# Altium schematic sheet 0036_PCH_DMI.SchDoc
size 848 x 558 mm
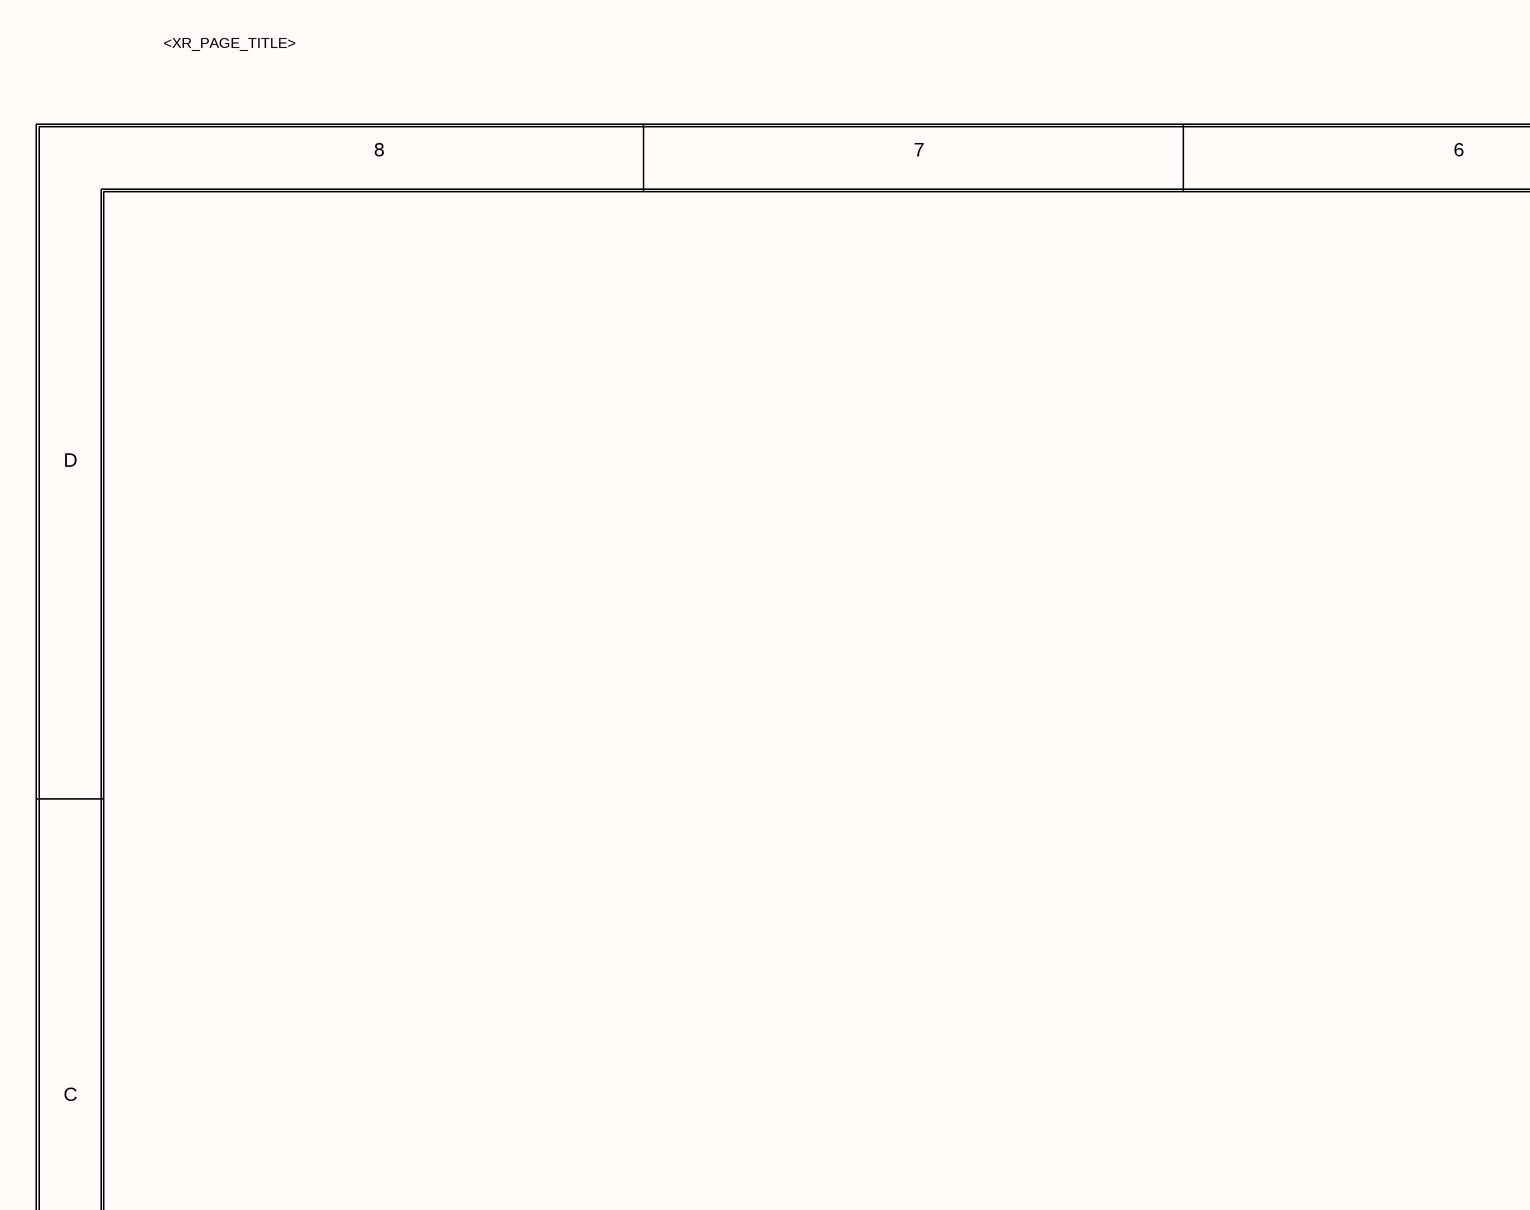
[diagram p0: 0036_PCH_DMI.SchDoc, top left]
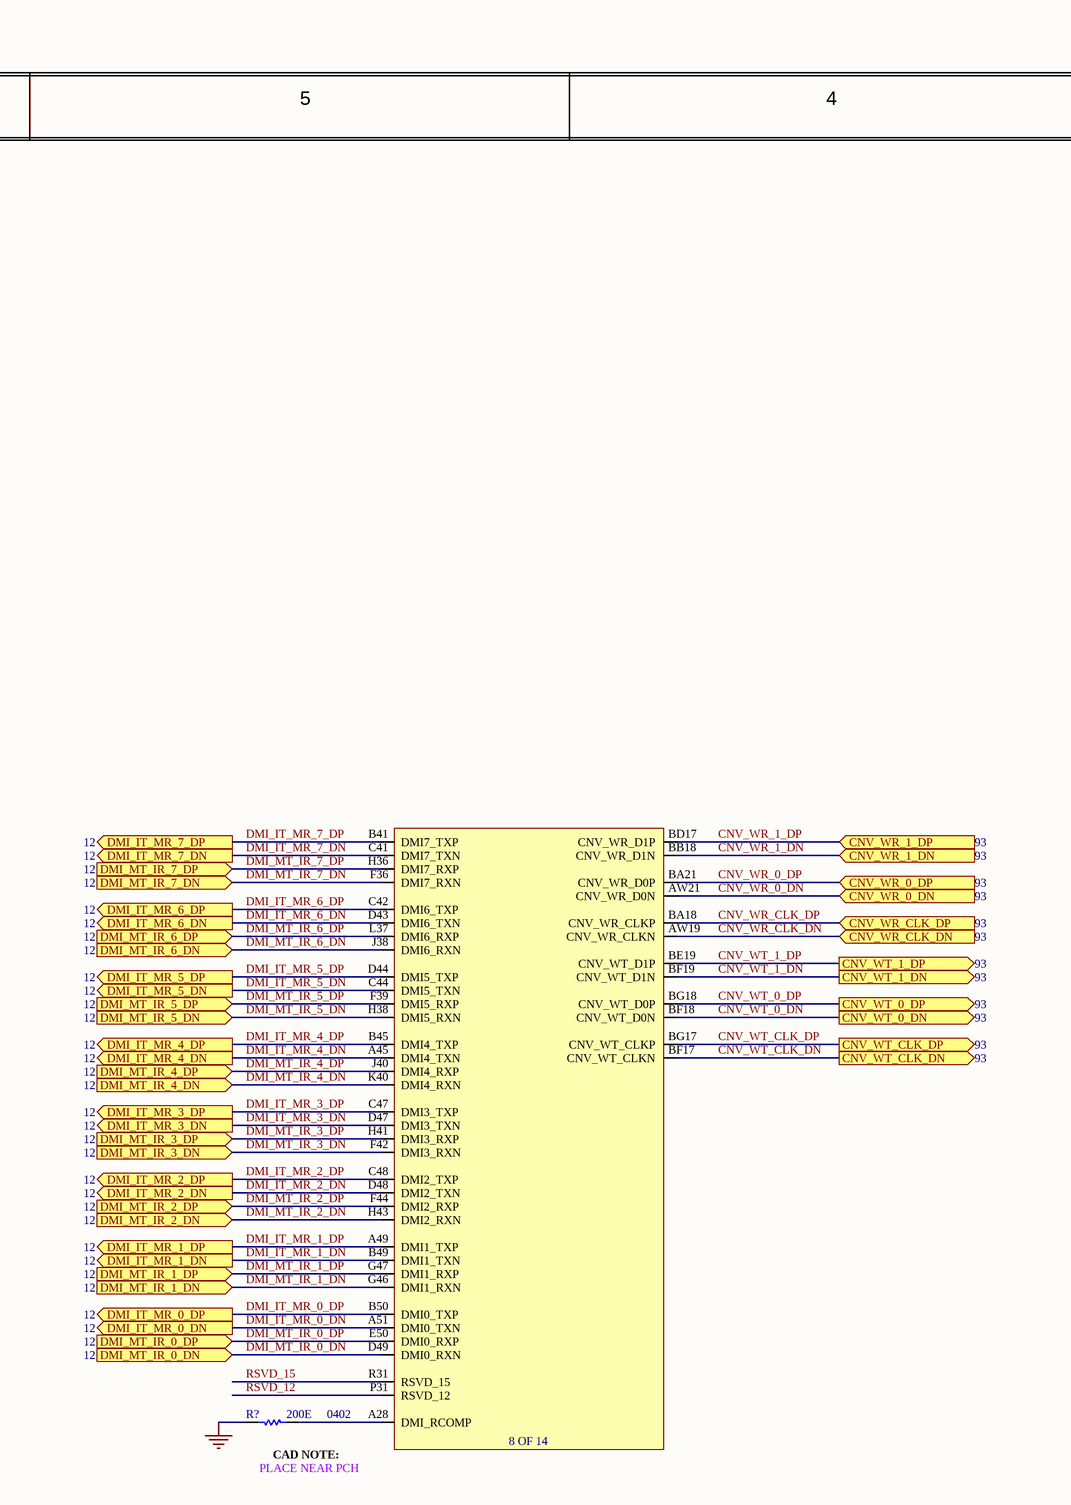
[diagram p1: 0036_PCH_DMI.SchDoc, top middle]
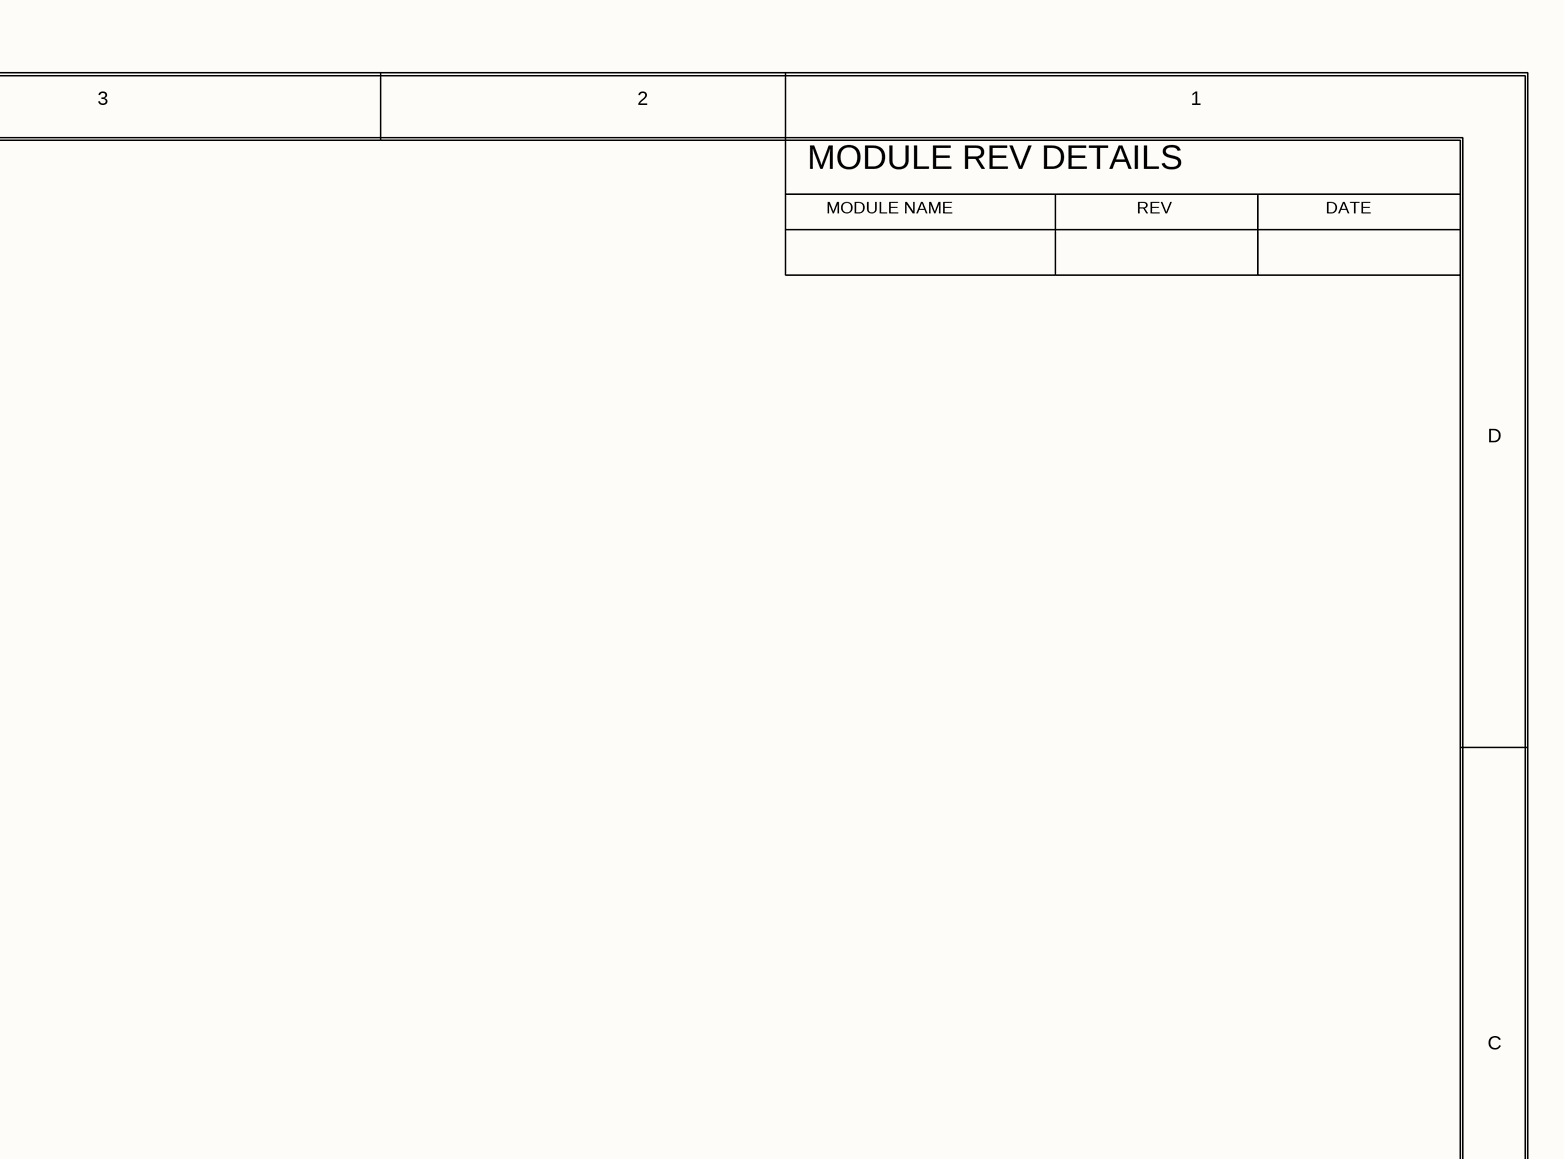
[diagram p2: 0036_PCH_DMI.SchDoc, top right]
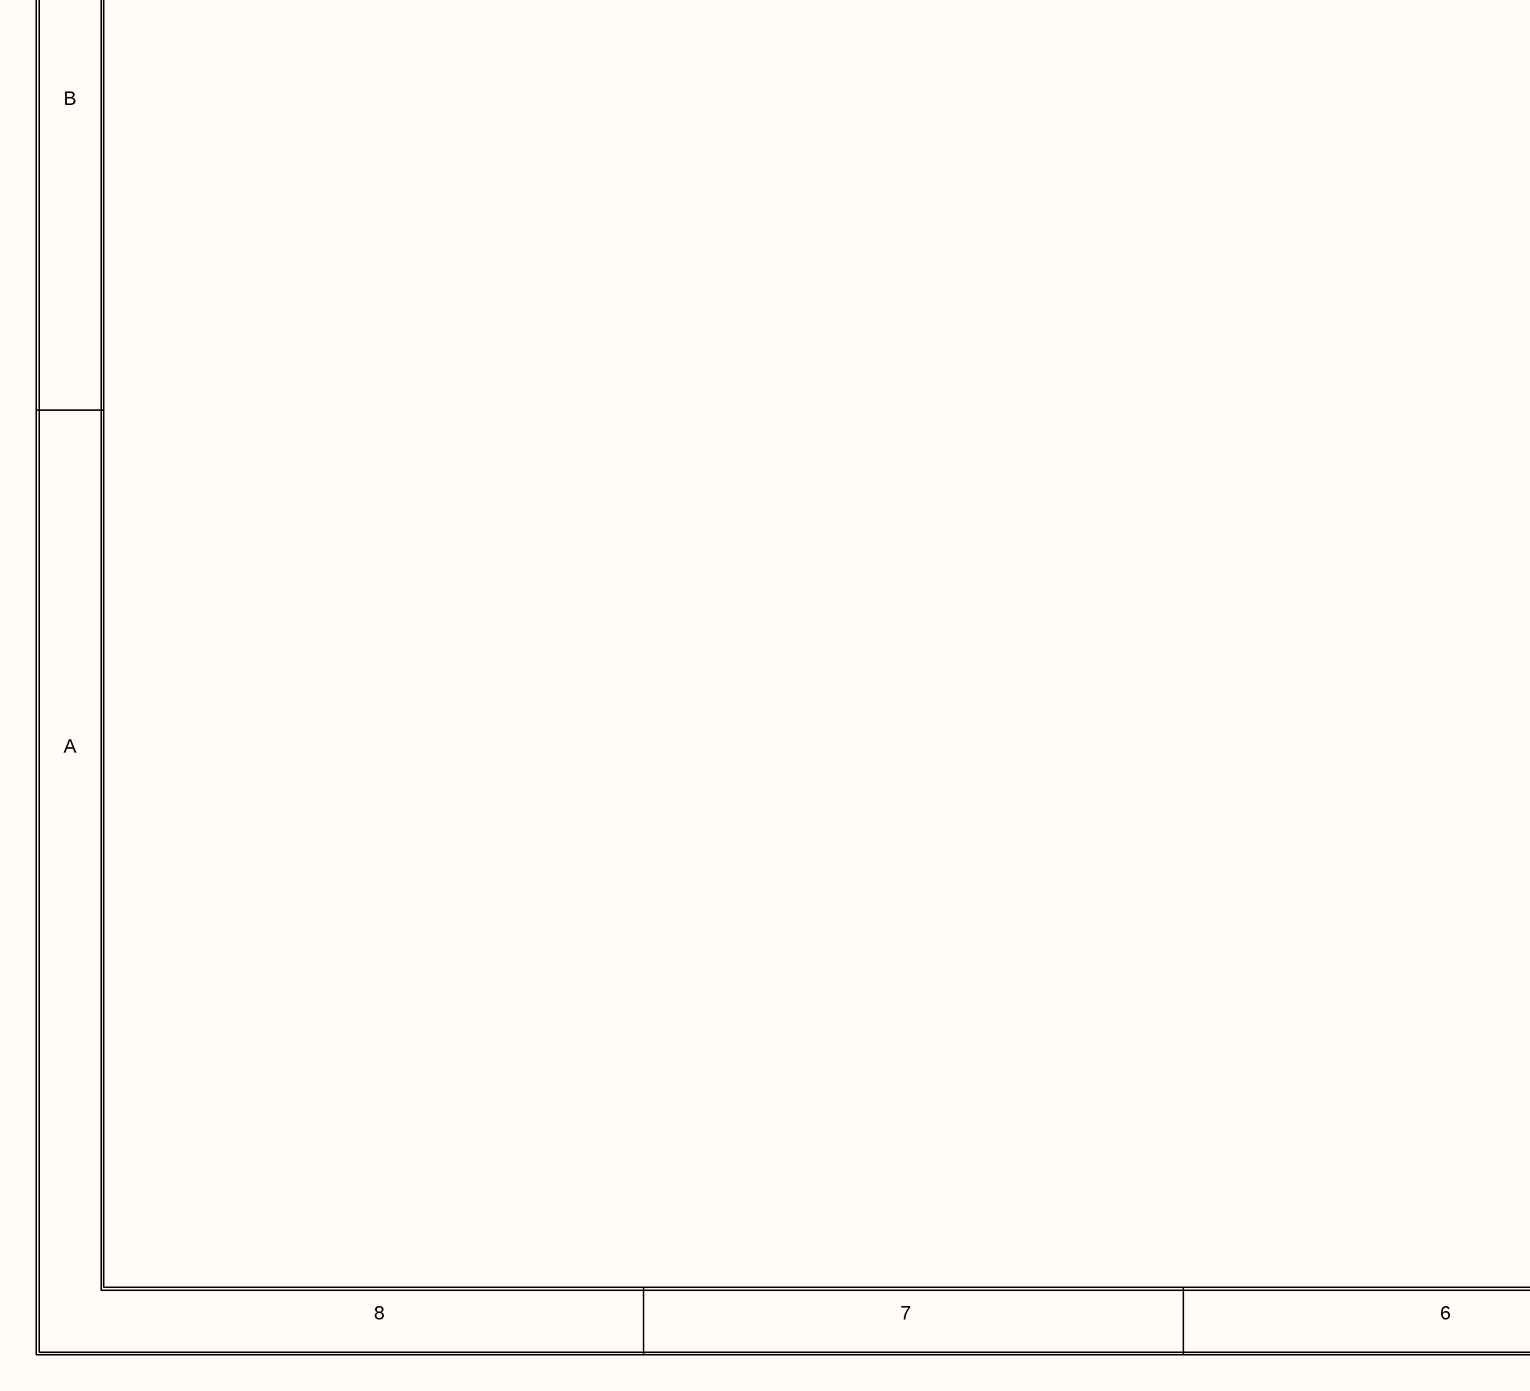
[diagram p3: 0036_PCH_DMI.SchDoc, bottom left]
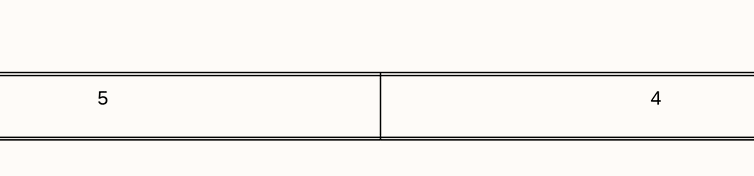
[diagram p4: 0036_PCH_DMI.SchDoc, bottom middle]
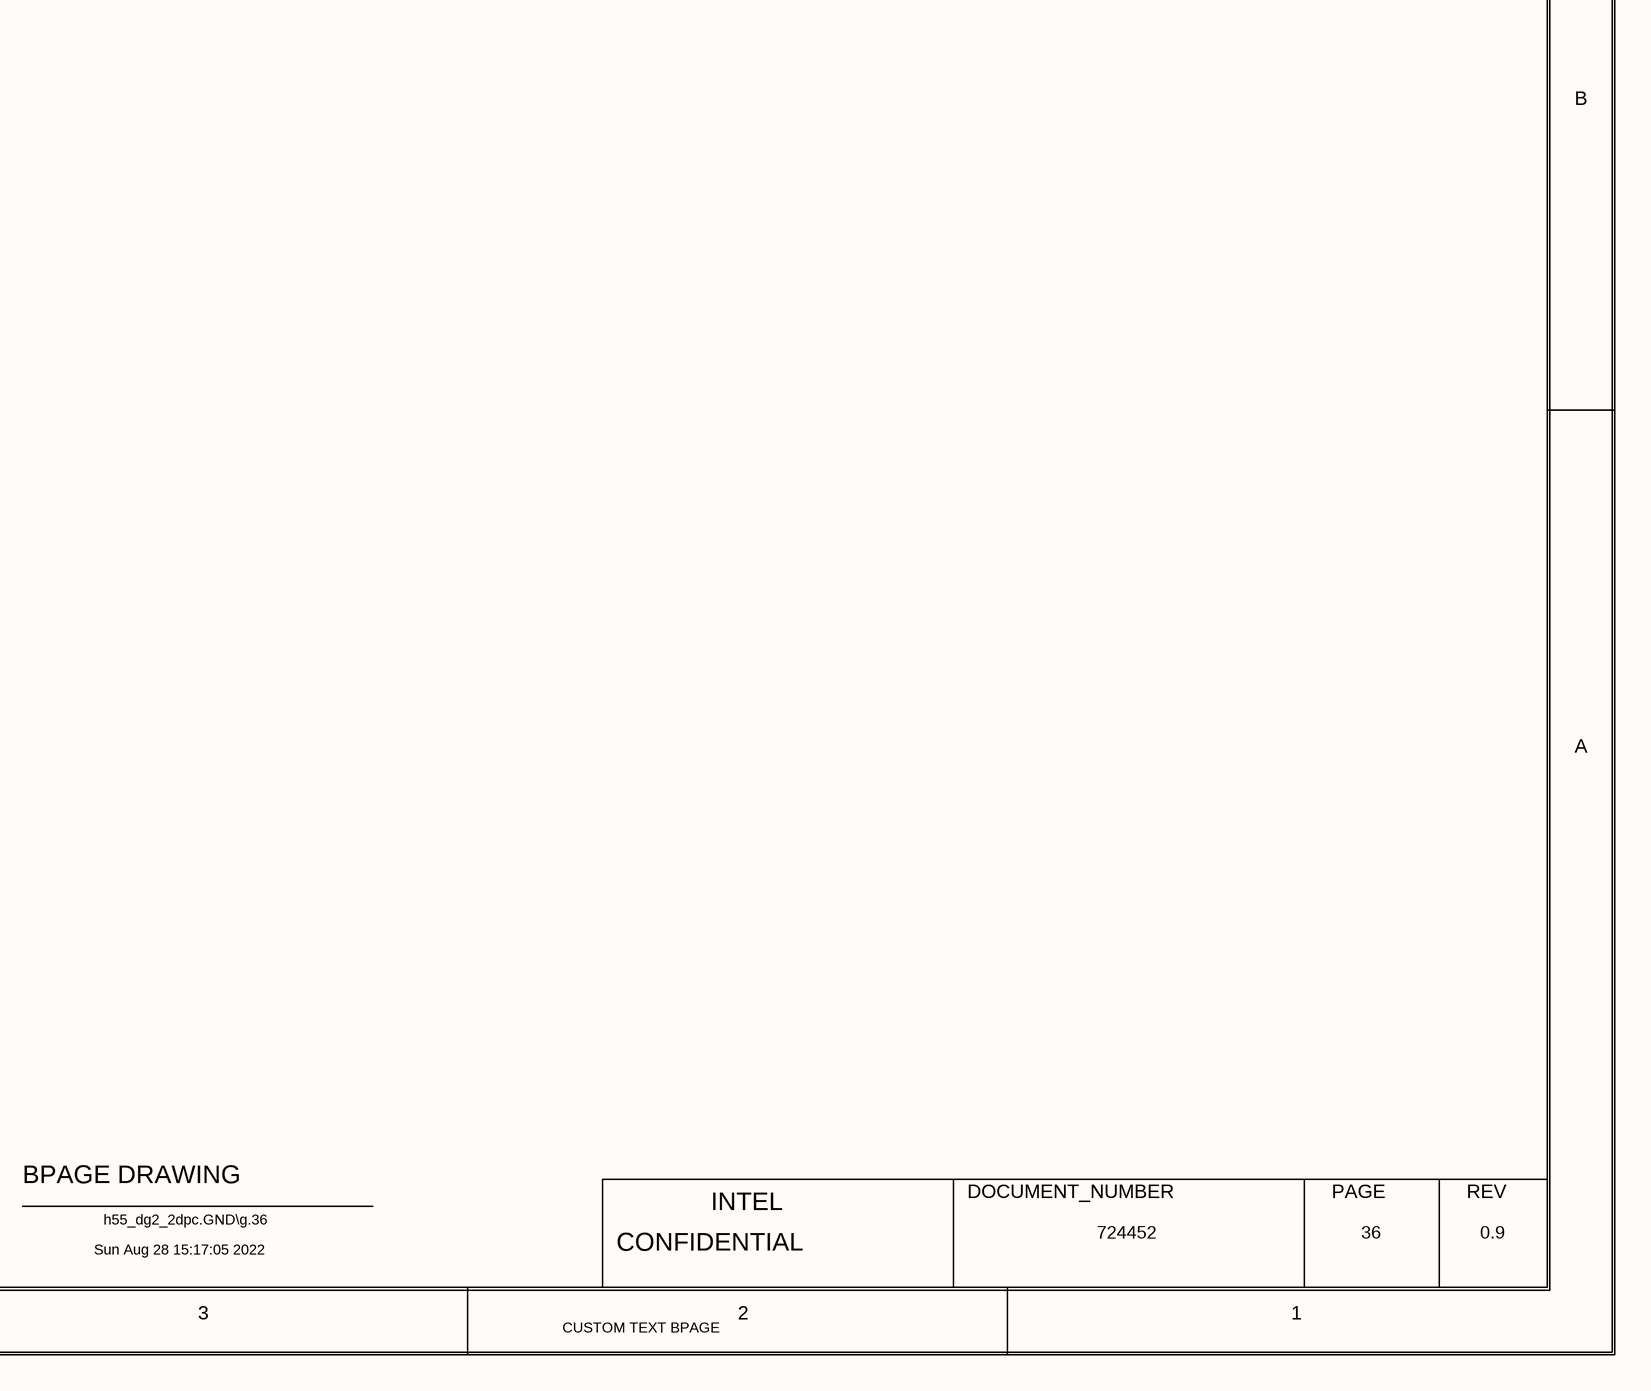
[diagram p5: 0036_PCH_DMI.SchDoc, bottom right]

## Parts
R?  value 200E  Case/Package: 0402  [RESC0402]  (hidden comment: Res)
U23601  C_RPL_S_PCH_EXT  (value not drawn)  (part H of 14)

## Ports
CNV_WR_0_DN (in), CNV_WR_0_DP (in), CNV_WR_1_DN (in), CNV_WR_1_DP (in), CNV_WR_CLK_DN (in), CNV_WR_CLK_DP (in), CNV_WT_0_DN (out), CNV_WT_0_DP (out), CNV_WT_1_DN (out), CNV_WT_1_DP (out), CNV_WT_CLK_DN (out), CNV_WT_CLK_DP (out), DMI_IT_MR_0_DN (out), DMI_IT_MR_0_DP (out), DMI_IT_MR_1_DN (out), DMI_IT_MR_1_DP (out), DMI_IT_MR_2_DN (out), DMI_IT_MR_2_DP (out), DMI_IT_MR_3_DN (out), DMI_IT_MR_3_DP (out), DMI_IT_MR_4_DN (out), DMI_IT_MR_4_DP (out), DMI_IT_MR_5_DN (out), DMI_IT_MR_5_DP (out), DMI_IT_MR_6_DN (out), DMI_IT_MR_6_DP (out), DMI_IT_MR_7_DN (out), DMI_IT_MR_7_DP (out), DMI_MT_IR_0_DN (in), DMI_MT_IR_0_DP (in), DMI_MT_IR_1_DN (in), DMI_MT_IR_1_DP (in), DMI_MT_IR_2_DN (in), DMI_MT_IR_2_DP (in), DMI_MT_IR_3_DN (in), DMI_MT_IR_3_DP (in), DMI_MT_IR_4_DN (in), DMI_MT_IR_4_DP (in), DMI_MT_IR_5_DN (in), DMI_MT_IR_5_DP (in), DMI_MT_IR_6_DN (in), DMI_MT_IR_6_DP (in), DMI_MT_IR_7_DN (in), DMI_MT_IR_7_DP (in)

## Nets
GND: R?.1
CNV_WR_0_DN: U23601.AW21(CNV_WR_D0N) ; port CNV_WR_0_DN
CNV_WR_0_DP: U23601.BA21(CNV_WR_D0P) ; port CNV_WR_0_DP
CNV_WR_1_DN: U23601.BB18(CNV_WR_D1N) ; port CNV_WR_1_DN
CNV_WR_1_DP: U23601.BD17(CNV_WR_D1P) ; port CNV_WR_1_DP
CNV_WR_CLK_DN: U23601.AW19(CNV_WR_CLKN) ; port CNV_WR_CLK_DN
CNV_WR_CLK_DP: U23601.BA18(CNV_WR_CLKP) ; port CNV_WR_CLK_DP
CNV_WT_0_DN: U23601.BF18(CNV_WT_D0N) ; port CNV_WT_0_DN
CNV_WT_0_DP: U23601.BG18(CNV_WT_D0P) ; port CNV_WT_0_DP
CNV_WT_1_DN: U23601.BF19(CNV_WT_D1N) ; port CNV_WT_1_DN
CNV_WT_1_DP: U23601.BE19(CNV_WT_D1P) ; port CNV_WT_1_DP
CNV_WT_CLK_DN: U23601.BF17(CNV_WT_CLKN) ; port CNV_WT_CLK_DN
CNV_WT_CLK_DP: U23601.BG17(CNV_WT_CLKP) ; port CNV_WT_CLK_DP
DMI_IT_MR_0_DN: U23601.A51(DMI0_TXN) ; port DMI_IT_MR_0_DN
DMI_IT_MR_0_DP: U23601.B50(DMI0_TXP) ; port DMI_IT_MR_0_DP
DMI_IT_MR_1_DN: U23601.B49(DMI1_TXN) ; port DMI_IT_MR_1_DN
DMI_IT_MR_1_DP: U23601.A49(DMI1_TXP) ; port DMI_IT_MR_1_DP
DMI_IT_MR_2_DN: U23601.D48(DMI2_TXN) ; port DMI_IT_MR_2_DN
DMI_IT_MR_2_DP: U23601.C48(DMI2_TXP) ; port DMI_IT_MR_2_DP
DMI_IT_MR_3_DN: U23601.D47(DMI3_TXN) ; port DMI_IT_MR_3_DN
DMI_IT_MR_3_DP: U23601.C47(DMI3_TXP) ; port DMI_IT_MR_3_DP
DMI_IT_MR_4_DN: U23601.A45(DMI4_TXN) ; port DMI_IT_MR_4_DN
DMI_IT_MR_4_DP: U23601.B45(DMI4_TXP) ; port DMI_IT_MR_4_DP
DMI_IT_MR_5_DN: U23601.C44(DMI5_TXN) ; port DMI_IT_MR_5_DN
DMI_IT_MR_5_DP: U23601.D44(DMI5_TXP) ; port DMI_IT_MR_5_DP
DMI_IT_MR_6_DN: U23601.D43(DMI6_TXN) ; port DMI_IT_MR_6_DN
DMI_IT_MR_6_DP: U23601.C42(DMI6_TXP) ; port DMI_IT_MR_6_DP
DMI_IT_MR_7_DN: U23601.C41(DMI7_TXN) ; port DMI_IT_MR_7_DN
DMI_IT_MR_7_DP: U23601.B41(DMI7_TXP) ; port DMI_IT_MR_7_DP
DMI_MT_IR_0_DN: U23601.D49(DMI0_RXN) ; port DMI_MT_IR_0_DN
DMI_MT_IR_0_DP: U23601.E50(DMI0_RXP) ; port DMI_MT_IR_0_DP
DMI_MT_IR_1_DN: U23601.G46(DMI1_RXN) ; port DMI_MT_IR_1_DN
DMI_MT_IR_1_DP: U23601.G47(DMI1_RXP) ; port DMI_MT_IR_1_DP
DMI_MT_IR_2_DN: U23601.H43(DMI2_RXN) ; port DMI_MT_IR_2_DN
DMI_MT_IR_2_DP: U23601.F44(DMI2_RXP) ; port DMI_MT_IR_2_DP
DMI_MT_IR_3_DN: U23601.F42(DMI3_RXN) ; port DMI_MT_IR_3_DN
DMI_MT_IR_3_DP: U23601.H41(DMI3_RXP) ; port DMI_MT_IR_3_DP
DMI_MT_IR_4_DN: U23601.K40(DMI4_RXN) ; port DMI_MT_IR_4_DN
DMI_MT_IR_4_DP: U23601.J40(DMI4_RXP) ; port DMI_MT_IR_4_DP
DMI_MT_IR_5_DN: U23601.H38(DMI5_RXN) ; port DMI_MT_IR_5_DN
DMI_MT_IR_5_DP: U23601.F39(DMI5_RXP) ; port DMI_MT_IR_5_DP
DMI_MT_IR_6_DN: U23601.J38(DMI6_RXN) ; port DMI_MT_IR_6_DN
DMI_MT_IR_6_DP: U23601.L37(DMI6_RXP) ; port DMI_MT_IR_6_DP
DMI_MT_IR_7_DN: U23601.F36(DMI7_RXN) ; port DMI_MT_IR_7_DN
DMI_MT_IR_7_DP: U23601.H36(DMI7_RXP) ; port DMI_MT_IR_7_DP
RSVD_12: U23601.P31(RSVD_12)
RSVD_15: U23601.R31(RSVD_15)
NetR?_2: R?.2 U23601.A28(DMI_RCOMP)

## Notes on the sheet
- <XR_PAGE_TITLE>
- 8
- 7
- 6
- 5
- 4
- 3
- 2
- 1
- MODULE REV DETAILS
- MODULE NAME
- REV
- DATE
- D
- C
- PLACE NEAR PCH
- (near R?) CAD NOTE:
- B
- A
- BPAGE DRAWING
- INTEL
- DOCUMENT_NUMBER
- PAGE
- Sun Aug 28 15:17:05 2022
- h55_dg2_2dpc.GND\g.36
- CONFIDENTIAL
- 724452
- 36
- 0.9
- CUSTOM TEXT BPAGE
- (in symbol C_RPL_S_PCH_EXT, part H) 8 OF 14

## Library data of the parts
R? = Res: Thick Film Resistor -  200ohm, 1%, 0402
U23601 = C_RPL_S_PCH_EXT: Manufacturer Part Number: *; Case/Package: *